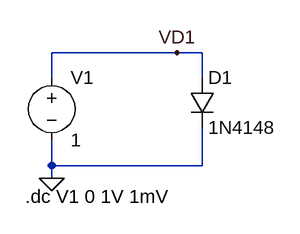
[diagram p0: schematic E2-barridoDC-1N4148.asc]
E2-barridoDC-1N4148.asc, the LTspice schematic file:
Version 4
SHEET 1 880 680
WIRE -16 80 -176 80
WIRE 16 80 -16 80
WIRE -176 112 -176 80
WIRE 16 112 16 80
WIRE -176 224 -176 192
WIRE 16 224 16 176
WIRE 16 224 -176 224
WIRE -176 240 -176 224
FLAG -176 240 0
FLAG -16 80 VD1
SYMBOL voltage -176 96 R0
WINDOW 123 0 0 Left 0
WINDOW 39 0 0 Left 0
SYMATTR InstName V1
SYMATTR Value 1
SYMBOL diode 0 112 R0
SYMATTR InstName D1
SYMATTR Value 1N4148
TEXT -210 264 Left 2 !.dc V1 0 1V 1mV

The netlist it stands for:
* E2-barridoDC-1N4148.asc
V1 VD1 0 1
D1 VD1 0 1N4148
.model D D
.lib standard.dio
.dc V1 0 1V 1mV
.backanno
.end